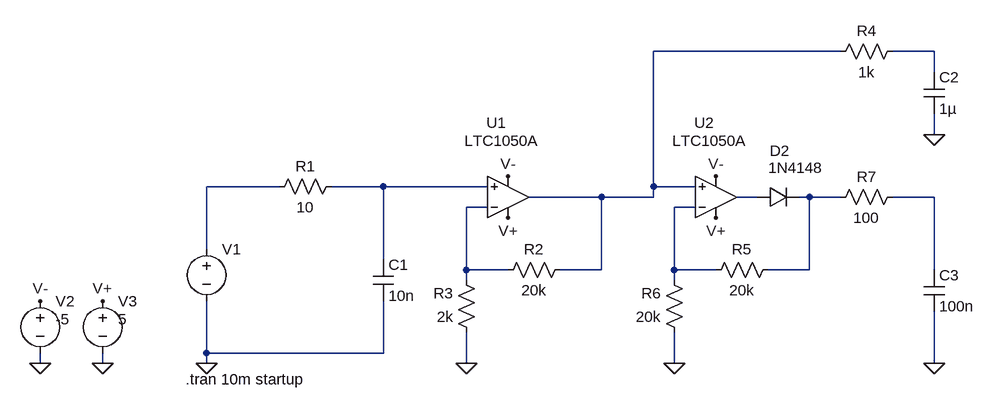
[diagram p0: schematic rivelatore-picco.asc]
rivelatore-picco.asc, the LTspice schematic file:
Version 4
SHEET 1 1480 680
WIRE 1024 -176 736 -176
WIRE 1168 -176 1104 -176
WIRE 1168 -144 1168 -176
WIRE 1168 -48 1168 -80
WIRE 160 32 48 32
WIRE 320 32 240 32
WIRE 480 32 320 32
WIRE 736 32 736 -176
WIRE 800 32 736 32
WIRE 656 48 544 48
WIRE 736 48 736 32
WIRE 736 48 656 48
WIRE 896 48 864 48
WIRE 976 48 960 48
WIRE 1024 48 976 48
WIRE 1168 48 1104 48
WIRE 480 64 448 64
WIRE 800 64 768 64
WIRE 48 128 48 32
WIRE 320 144 320 32
WIRE 448 160 448 64
WIRE 512 160 448 160
WIRE 656 160 656 48
WIRE 656 160 592 160
WIRE 768 160 768 64
WIRE 832 160 768 160
WIRE 976 160 976 48
WIRE 976 160 912 160
WIRE 1168 160 1168 48
WIRE 448 176 448 160
WIRE 768 176 768 160
WIRE 48 288 48 208
WIRE 320 288 320 208
WIRE 320 288 48 288
WIRE -208 304 -208 288
WIRE -112 304 -112 288
WIRE 48 304 48 288
WIRE 448 304 448 256
WIRE 768 304 768 256
WIRE 1168 304 1168 224
FLAG 48 304 0
FLAG -112 304 0
FLAG -208 304 0
FLAG -208 208 V-
FLAG -112 208 V+
FLAG 512 16 V-
FLAG 512 80 V+
FLAG 448 304 0
FLAG 1168 -48 0
FLAG 832 16 V-
FLAG 832 80 V+
FLAG 768 304 0
FLAG 1168 304 0
SYMBOL voltage 48 112 R0
WINDOW 3 24 44 Invisible 2
WINDOW 123 0 0 Left 0
WINDOW 39 0 0 Left 0
SYMATTR Value PULSE(0 150m 0 1u 1u 24u 50u 100)
SYMATTR InstName V1
SYMBOL res 256 16 R90
WINDOW 0 0 56 VBottom 2
WINDOW 3 32 56 VTop 2
SYMATTR InstName R1
SYMATTR Value 10
SYMBOL cap 304 144 R0
SYMATTR InstName C1
SYMATTR Value 10n
SYMBOL OpAmps\\LTC1050A 512 112 M180
WINDOW 0 -33 178 Left 2
WINDOW 3 -67 151 Left 2
SYMATTR InstName U1
SYMBOL voltage -208 192 R0
WINDOW 3 24 44 Left 2
WINDOW 123 0 0 Left 0
WINDOW 39 0 0 Left 0
SYMATTR Value -5
SYMATTR InstName V2
SYMBOL voltage -112 192 R0
WINDOW 3 24 44 Left 2
WINDOW 123 0 0 Left 0
WINDOW 39 0 0 Left 0
SYMATTR Value 5
SYMATTR InstName V3
SYMBOL res 608 144 R90
WINDOW 0 0 56 VBottom 2
WINDOW 3 32 56 VTop 2
SYMATTR InstName R2
SYMATTR Value 20k
SYMBOL res 464 272 R180
WINDOW 0 36 76 Left 2
WINDOW 3 36 40 Left 2
SYMATTR InstName R3
SYMATTR Value 2k
SYMBOL res 1120 -192 R90
WINDOW 0 0 56 VBottom 2
WINDOW 3 32 56 VTop 2
SYMATTR InstName R4
SYMATTR Value 1k
SYMBOL cap 1152 -144 R0
SYMATTR InstName C2
SYMATTR Value 1µ
SYMBOL OpAmps\\LTC1050A 832 112 M180
WINDOW 0 -33 178 Left 2
WINDOW 3 -67 151 Left 2
SYMATTR InstName U2
SYMBOL res 928 144 R90
WINDOW 0 0 56 VBottom 2
WINDOW 3 32 56 VTop 2
SYMATTR InstName R5
SYMATTR Value 20k
SYMBOL res 784 272 R180
WINDOW 0 36 76 Left 2
WINDOW 3 36 40 Left 2
SYMATTR InstName R6
SYMATTR Value 20k
SYMBOL diode 896 64 R270
WINDOW 0 72 34 VTop 2
WINDOW 3 77 59 VBottom 2
SYMATTR InstName D2
SYMATTR Value 1N4148
SYMBOL res 1120 32 R90
WINDOW 0 0 56 VBottom 2
WINDOW 3 32 56 VTop 2
SYMATTR InstName R7
SYMATTR Value 100
SYMBOL cap 1152 160 R0
SYMATTR InstName C3
SYMATTR Value 100n
TEXT 16 328 Left 2 !.tran 10m startup

The netlist it stands for:
* rivelatore-picco.asc
V1 N003 0 PULSE(0 150m 0 1u 1u 24u 50u 100)
R1 N004 N003 10
C1 N004 0 10n
XU1 N004 N008 V+ V- N001 LTC1050A  ; pins In+ In- V+ V- OUT
V2 V- 0 -5
V3 V+ 0 5
R2 N001 N008 20k
R3 0 N008 2k
R4 N002 N001 1k
C2 N002 0 1µ
XU2 N001 N009 V+ V- N005 LTC1050A  ; pins In+ In- V+ V- OUT
R5 N006 N009 20k
R6 0 N009 20k
D2 N005 N006 1N4148
R7 N007 N006 100
C3 N007 0 100n
.model D D
.lib standard.dio
.tran 10m startup
.backanno
.end